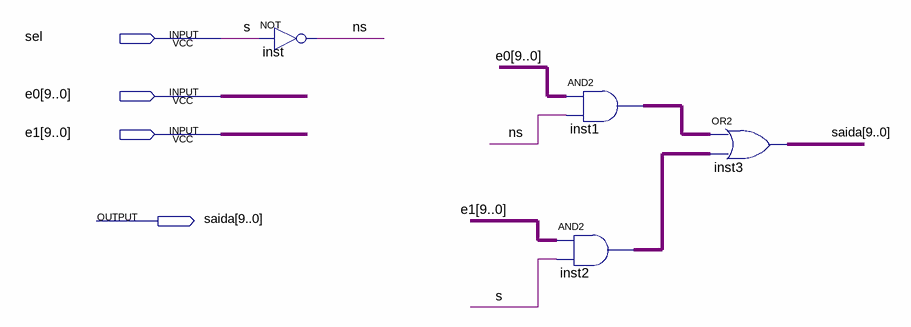
[diagram p0: schematic sheet]
// Quartus schematic mux2to1_10b.bdf as structural Verilog: 4 symbols, 4 pins
module mux2to1_10b (
  input  sel,
  input  [9:0] e0,
  input  [9:0] e1,
  output [9:0] saida
);

  wire ns;
  wire [9:0] inst1_out, inst2_out;

  not inst (ns, sel);
  assign inst1_out = e0 & {10{ns}};  // AND2 inst1, 10 bits wide
  assign inst2_out = e1 & {10{sel}};  // AND2 inst2, 10 bits wide
  assign saida = inst1_out | inst2_out;  // OR2 inst3, 10 bits wide

  // Other names for the same wires on the sheet: s = sel
endmodule
